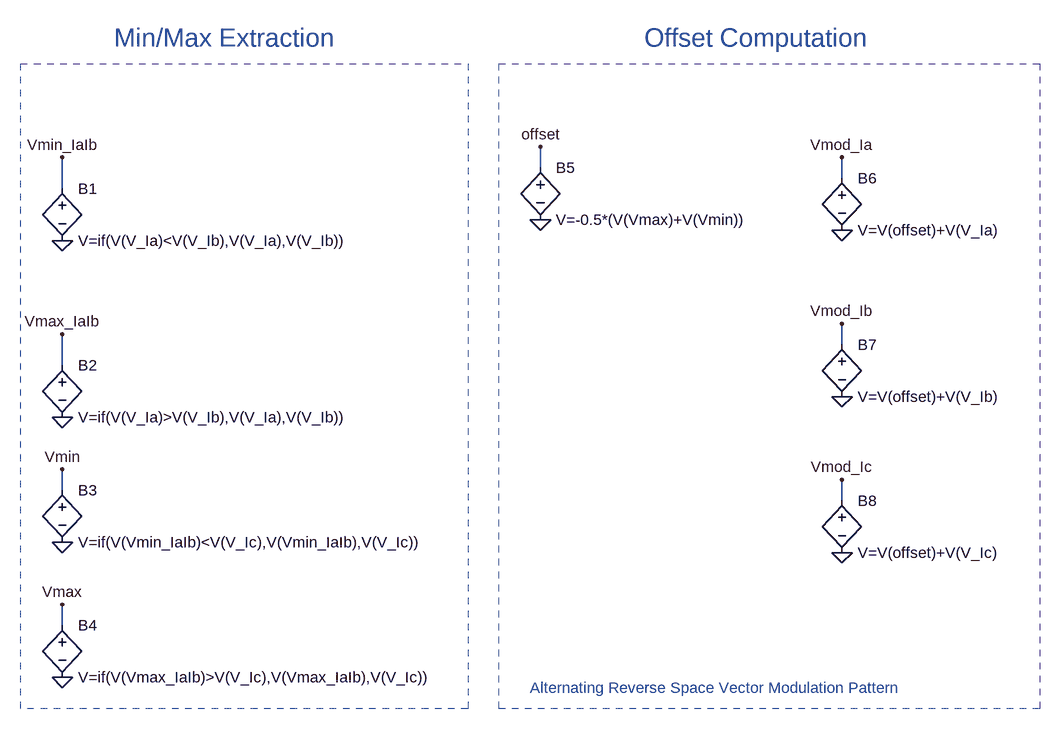
[diagram p0: schematic SVPWM_Min_Max_Injection.asc]
SVPWM_Min_Max_Injection.asc, the LTspice schematic file:
Version 4
SHEET 1 1060 680
WIRE 288 -288 288 -320
WIRE 752 -272 752 -304
WIRE -448 -256 -448 -304
WIRE 752 -16 752 -48
WIRE -448 16 -448 -32
WIRE -448 208 -448 176
WIRE 752 224 752 192
WIRE -448 416 -448 384
FLAG -448 -176 0
FLAG -448 -304 Vmin_IaIb
FLAG -448 96 0
FLAG -448 -32 Vmax_IaIb
FLAG -448 288 0
FLAG -448 496 0
FLAG -448 176 Vmin
FLAG -448 384 Vmax
FLAG 288 -208 0
FLAG 288 -320 offset
FLAG 752 -192 0
FLAG 752 -304 Vmod_Ia
FLAG 752 64 0
FLAG 752 -48 Vmod_Ib
FLAG 752 304 0
FLAG 752 192 Vmod_Ic
SYMBOL bv -448 -272 R0
SYMATTR InstName B1
SYMATTR Value V=if(V(V_Ia)<V(V_Ib),V(V_Ia),V(V_Ib))
SYMBOL bv -448 0 R0
SYMATTR InstName B2
SYMATTR Value V=if(V(V_Ia)>V(V_Ib),V(V_Ia),V(V_Ib))
SYMBOL bv -448 192 R0
SYMATTR InstName B3
SYMATTR Value V=if(V(Vmin_IaIb)<V(V_Ic),V(Vmin_IaIb),V(V_Ic))
SYMBOL bv -448 400 R0
SYMATTR InstName B4
SYMATTR Value V=if(V(Vmax_IaIb)>V(V_Ic),V(Vmax_IaIb),V(V_Ic))
SYMBOL bv 288 -304 R0
SYMATTR InstName B5
SYMATTR Value V=-0.5*(V(Vmax)+V(Vmin))
SYMBOL bv 752 -288 R0
SYMATTR InstName B6
SYMATTR Value V=V(offset)+V(V_Ia)
SYMBOL bv 752 -32 R0
SYMATTR InstName B7
SYMATTR Value V=V(offset)+V(V_Ib)
SYMBOL bv 752 208 R0
SYMATTR InstName B8
SYMATTR Value V=V(offset)+V(V_Ic)
TEXT -368 -488 Left 4 ;Min/Max Extraction
TEXT 448 -488 Left 4 ;Offset Computation
TEXT 272 512 Left 2 ;Alternating Reverse Space Vector Modulation Pattern
RECTANGLE Normal 176 544 -512 -448 2
RECTANGLE Normal 1056 544 224 -448 2

The netlist it stands for:
* SVPWM_Min_Max_Injection.asc
B1 Vmin_IaIb 0 V=if(V(V_Ia)<V(V_Ib),V(V_Ia),V(V_Ib))
B2 Vmax_IaIb 0 V=if(V(V_Ia)>V(V_Ib),V(V_Ia),V(V_Ib))
B3 Vmin 0 V=if(V(Vmin_IaIb)<V(V_Ic),V(Vmin_IaIb),V(V_Ic))
B4 Vmax 0 V=if(V(Vmax_IaIb)>V(V_Ic),V(Vmax_IaIb),V(V_Ic))
B5 offset 0 V=-0.5*(V(Vmax)+V(Vmin))
B6 Vmod_Ia 0 V=V(offset)+V(V_Ia)
B7 Vmod_Ib 0 V=V(offset)+V(V_Ib)
B8 Vmod_Ic 0 V=V(offset)+V(V_Ic)
* Min/Max Extraction
* Offset Computation
* Alternating Reverse Space Vector Modulation Pattern
.backanno
.end